# Altium schematic sheet chess_module_HEF.SchDoc
size A; SheetNumber: 2; SheetTotal: 3
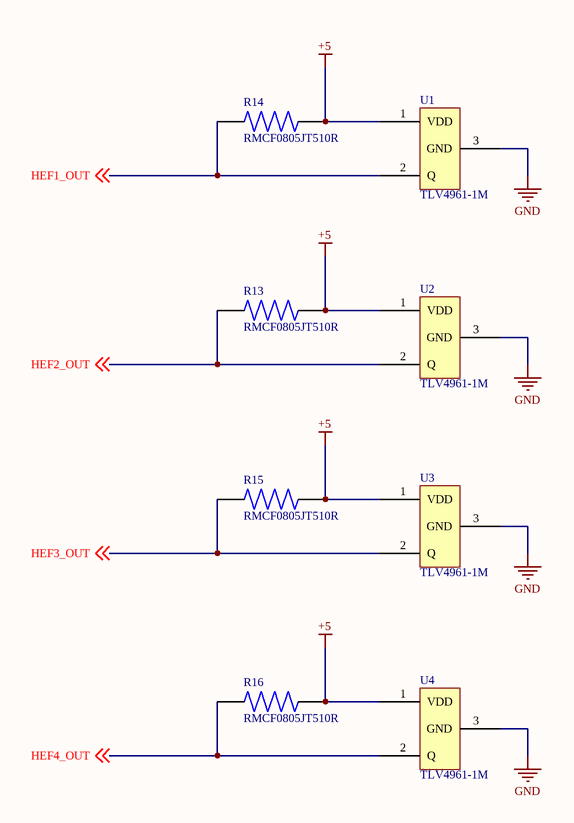
[diagram p0: chess_module_HEF.SchDoc]

## Parts
R13  RMCF0805JT510R  [RESC2012X65N]
R14  RMCF0805JT510R  [RESC2012X65N]
R15  RMCF0805JT510R  [RESC2012X65N]
R16  RMCF0805JT510R  [RESC2012X65N]
U1  TLV4961-1M  [SOT95P245X110-3N]
U2  TLV4961-1M  [SOT95P245X110-3N]
U3  TLV4961-1M  [SOT95P245X110-3N]
U4  TLV4961-1M  [SOT95P245X110-3N]

## Nets
+5: R13.2 R14.2 R15.2 R16.2 U1.1(VDD) U2.1(VDD) U3.1(VDD) U4.1(VDD)
GND: U1.3(GND) U2.3(GND) U3.3(GND) U4.3(GND)
HEF1_OUT: R14.1 U1.2(Q) ; off-sheet HEF1_OUT
HEF2_OUT: R13.1 U2.2(Q) ; off-sheet HEF2_OUT
HEF3_OUT: R15.1 U3.2(Q) ; off-sheet HEF3_OUT
HEF4_OUT: R16.1 U4.2(Q) ; off-sheet HEF4_OUT

## Library data of the parts
U1-U4 = TLV4961-1M: Hall Effect Sensor
R13-R16 = RMCF0805JT510R: Package: None; Price: None; Value: *; MP: RMCF0805JT510R; Availability: Unavailable